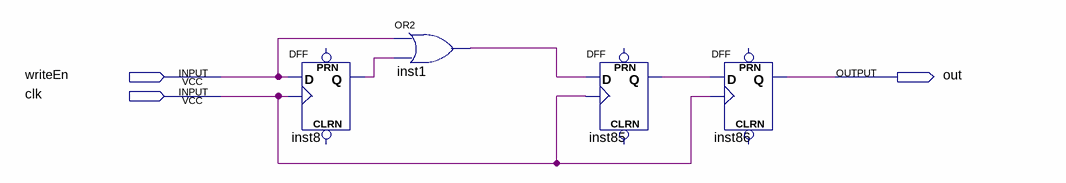
[diagram p0: schematic sheet]
// Quartus schematic four.bdf as structural Verilog: 4 symbols, 3 pins
module four (
  input  writeEn,
  input  clk,
  output out
);

  wire inst1_out, inst8_q, inst85_q;

  DFF inst8 (.CLK(clk), .D(writeEn), .Q(inst8_q));  // open: CLRN, PRN
  or inst1 (inst1_out, writeEn, inst8_q);
  DFF inst85 (.CLK(clk), .D(inst1_out), .Q(inst85_q));  // open: CLRN, PRN
  DFF inst86 (.CLK(clk), .D(inst85_q), .Q(out));  // open: CLRN, PRN
endmodule
